# EAGLE design powerlinecontroller (EAGLE 5.08)
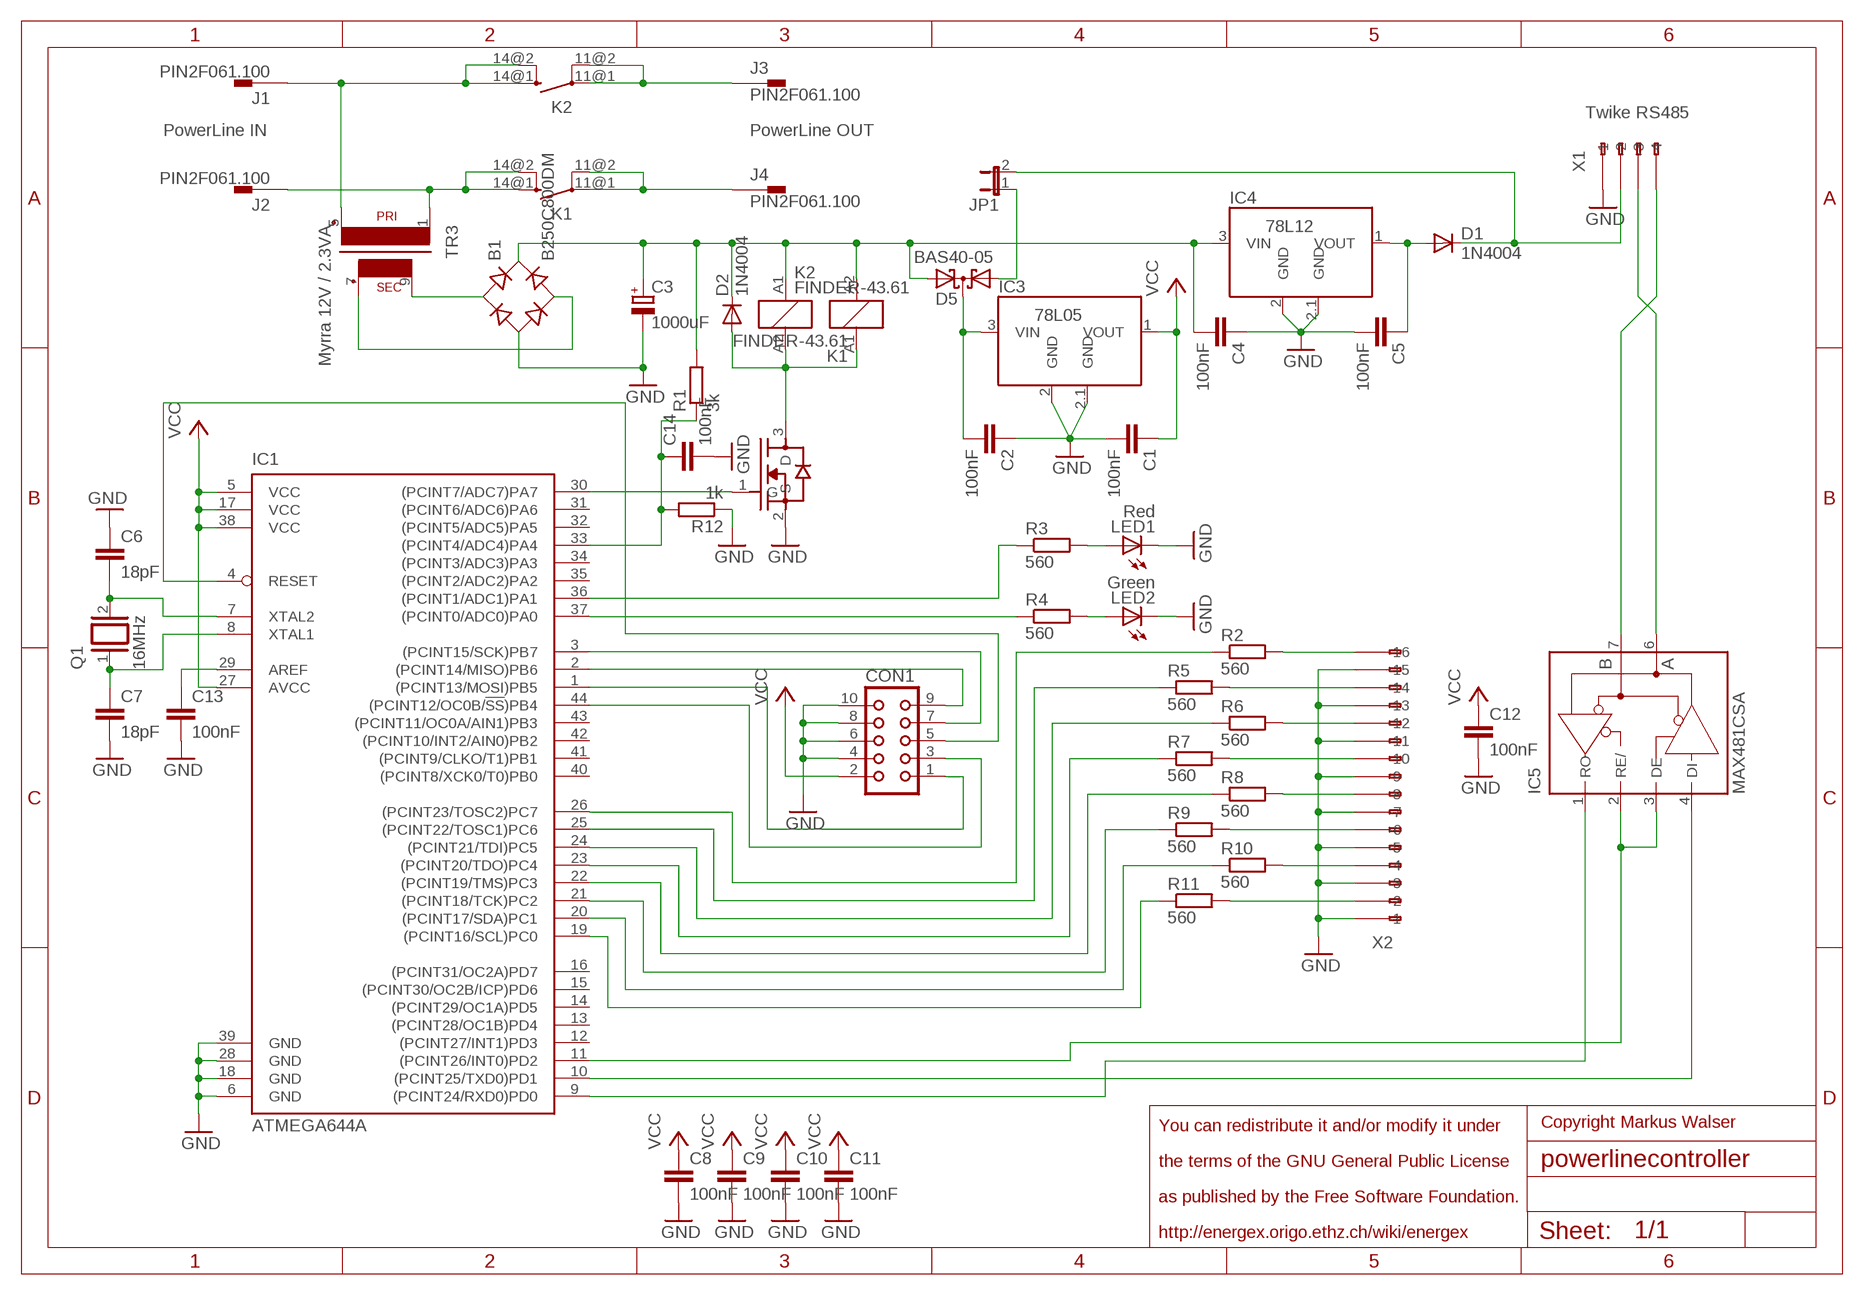
[diagram p0: schematic, sheet 1]

## Parts
B1  B250C800DM  B-DIL  [B-DIL]
C1  100nF  C-EUC0603  [C0603]
C2  100nF  C-EUC0603  [C0603]
C3  1000uF  CPOL-EUE3.5-10  [E3,5-10]
C4  100nF  C-EUC0603  [C0603]
C5  100nF  C-EUC0603  [C0603]
C6  18pF  C-EUC0603K  [C0603K]
C7  18pF  C-EUC0603K  [C0603K]
C8  100nF  C-EUC0603  [C0603]
C9  100nF  C-EUC0603  [C0603]
C10  100nF  C-EUC0603  [C0603]
C11  100nF  C-EUC0603  [C0603]
C12  100nF  C-EUC0603  [C0603]
C13  100nF  C-EUC0603  [C0603]
C14  100nF  C-EUC0603  [C0603]
CON1  CON10  [CON10]
D1  1N4004  [DO41-10]
D2  1N4004  [DO41-10]
D5  BAS40-05  [SOT23]
IC1  ATMEGA644A  [TQFP44]
IC3  78L05  [SOT89]
IC4  78L12  78L05  [SOT89]
IC5  MAX481CSA  [SO08]
J1  PIN2F061.100  [F061.100]
J2  PIN2F061.100  [F061.100]
J3  PIN2F061.100  [F061.100]
J4  PIN2F061.100  [F061.100]
JP1  JP1E  [JP1]
K1  FINDER-43.61  [FINDER-43.61]
K2  FINDER-43.61  [FINDER-43.61]
LED1  Red  LEDCHIPLED_0805  [CHIPLED_0805]
LED2  Green  LEDCHIPLED_0805  [CHIPLED_0805]
Q1  16MHz  XTAL/S  [QS]
R1  3k  R-EU_R0603  [R0603]
R2  560  R-EU_R0603  [R0603]
R3  560  R-EU_R0603  [R0603]
R4  560  R-EU_R0603  [R0603]
R5  560  R-EU_R0603  [R0603]
R6  560  R-EU_R0603  [R0603]
R7  560  R-EU_R0603  [R0603]
R8  560  R-EU_R0603  [R0603]
R9  560  R-EU_R0603  [R0603]
R10  560  R-EU_R0603  [R0603]
R11  560  R-EU_R0603  [R0603]
R12  1k  R-EU_R0603  [R0603]
T1  FDN337  FDN337N  [SOT23]
TR3  Myrra 12V / 2.3VA  VV11  [VV11]
X1  233-104  [233-104]
X2  233-116  [233-116]

## Nets
GND: B1.- C1.2 C2.1 C3.- C4.1 C5.2 C6.1 C7.2 C8.2 C9.2 C10.2 C11.2 C12.2 C13.2 C14.2 CON1.4 CON1.6 CON1.8 CON1.10 IC1.6(GND) IC1.18(GND) IC1.28(GND) IC1.39(GND) IC3.2(GND) IC3.2.1(GND) IC4.2(GND) IC4.2.1(GND) LED1.C LED2.C R12.1 T1.2(S) X1.A1(-1) X2.A1(-1) X2.A3(-3) X2.A5(-5) X2.A7(-7) X2.A9(-9) X2.A11(-11) X2.A13(-13) X2.A15(-15)
N$1: IC1.9((PCINT24/RXD0)PD0) IC5.1(RO)
N$2: IC1.10((PCINT25/TXD0)PD1) IC5.4(DI)
N$3: C14.1 IC1.33((PCINT4/ADC4)PA4) R1.1 R12.2
N$4: D1.C JP1.2 X1.A2(-2)
N$5: C13.1 IC1.29(AREF)
N$6: J2.A1 K1.14@1(-1:SA) K1.14@2(-1:SB) TR3.1
N$7: J1.A1 K2.14@1(-1:SA) K2.14@2(-1:SB) TR3.5(P2)
N$8: J3.A1 K2.11@1(-1:PA) K2.11@2(-1:PB)
N$9: B1.AC1 TR3.9(S4)
N$10: B1.AC2 TR3.7(S3)
N$11: IC5.6(A) X1.A3(-3)
N$12: C5.1 D1.A IC4.1(VOUT)
N$13: IC5.7(B) X1.A4(-4)
N$14: C6.2 IC1.7(XTAL2) Q1.2
N$15: C7.1 IC1.8(XTAL1) Q1.1
N$16: B1.+ C3.+ C4.2 D2.C D5.2(A2) IC4.3(VIN) K1.A2 K2.A1 R1.2
N$17: CON1.1 IC1.1((PCINT13/MOSI)PB5)
N$18: CON1.3 IC1.44((PCINT12/OC0B/!SS!)PB4)
N$19: CON1.5 IC1.4(RESET)
N$20: CON1.7 IC1.3((PCINT15/SCK)PB7)
N$21: CON1.9 IC1.2((PCINT14/MISO)PB6)
N$22: D2.A K1.A1 K2.A2 T1.3(D)
N$23: IC1.30((PCINT7/ADC7)PA7) T1.1(G)
N$24: IC1.37((PCINT0/ADC0)PA0) R4.1
N$25: IC1.36((PCINT1/ADC1)PA1) R3.1
N$26: LED1.A R3.2
N$27: LED2.A R4.2
N$28: IC1.19((PCINT16/SCL)PC0) R11.1
N$29: IC1.20((PCINT17/SDA)PC1) R10.1
N$30: IC1.21((PCINT18/TCK)PC2) R9.1
N$31: IC1.22((PCINT19/TMS)PC3) R8.1
N$32: IC1.23((PCINT20/TDO)PC4) R7.1
N$33: IC1.24((PCINT21/TDI)PC5) R6.1
N$34: IC1.11((PCINT26/INT0)PD2) IC5.2(RE/) IC5.3(DE)
N$35: IC1.25((PCINT22/TOSC1)PC6) R5.1
N$36: IC1.26((PCINT23/TOSC2)PC7) R2.1
N$37: J4.A1 K1.11@1(-1:PA) K1.11@2(-1:PB)
N$38: R2.2 X2.A16(-16)
N$39: R5.2 X2.A14(-14)
N$40: R6.2 X2.A12(-12)
N$41: R7.2 X2.A10(-10)
N$42: R8.2 X2.A8(-8)
N$43: R9.2 X2.A6(-6)
N$44: R10.2 X2.A4(-4)
N$45: R11.2 X2.A2(-2)
N$46: C2.2 D5.3(C) IC3.3(VIN)
N$47: D5.1(A1) JP1.1
VCC: C1.1 C8.1 C9.1 C10.1 C11.1 C12.1 CON1.2 IC1.5(VCC) IC1.17(VCC) IC1.27(AVCC) IC1.38(VCC) IC3.1(VOUT)
Unconnected: IC1.12((PCINT27/INT1)PD3) IC1.13((PCINT28/OC1B)PD4) IC1.14((PCINT29/OC1A)PD5) IC1.15((PCINT30/OC2B/ICP)PD6) IC1.16((PCINT31/OC2A)PD7) IC1.31((PCINT6/ADC6)PA6) IC1.32((PCINT5/ADC5)PA5) IC1.34((PCINT3/ADC3)PA3) IC1.35((PCINT2/ADC2)PA2) IC1.40((PCINT8/XCK0/T0)PB0) IC1.41((PCINT9/CLKO/T1)PB1) IC1.42((PCINT10/INT2/AIN0)PB2) IC1.43((PCINT11/OC0A/AIN1)PB3) J1.A2(1.1) J2.A2(1.1) J3.A2(1.1) J4.A2(1.1) X1.B1(B-1) X1.B2(B-2) X1.B3(B-3) X1.B4(B-4) X2.B1(B-1) X2.B2(B-2) X2.B3(B-3) X2.B4(B-4) X2.B5(B-5) X2.B6(B-6) X2.B7(B-7) X2.B8(B-8) X2.B9(B-9) X2.B10(B-10) X2.B11(B-11) X2.B12(B-12) X2.B13(B-13) X2.B14(B-14) X2.B15(B-15) X2.B16(B-16)

## Notes on the sheet
- Twike RS485
- PowerLine IN | PowerLine OUT
- You can redistribute it and/or modify it under | Copyright Markus Walser
- the terms of the GNU General Public License
- as published by the Free Software Foundation.
- http://energex.origo.ethz.ch/wiki/energex

## Power pins joined to a net without a drawn wire
GND: IC5.5(GND)
VCC: IC5.8(VCC)

## Library data of the parts
B1 = rectifier:B-DIL: RECTIFIER
C1 C2 C4-C14 = rcl:C-EU: CAPACITOR, European symbol
C3 = rcl:CPOL-EU: POLARIZED CAPACITOR, European symbol
CON1 = con-harting:CON10: CONNECTOR
D1 D2 = diode:1N4004: DIODE general purpose rectifier, 1 A
D5 = diode:BAS40-05: Silicon Schottky Diodes General-purpose diode for high-speed switching
IC1 = atmel:ATMEGA644: 8-bit Microcontroller with 64K Bytes In-System Programmable Flash Source: http://www.atmel.com/dyn/resources/prod_documents/doc2593.pdf
IC3 IC4 = supervisor:78L05: Negative voltage regulators
IC5 = maxim:MAX481CSA: RS485 TRANSEIVER
J1-J4 = con-faston:PIN2: Flachstecker Typ Tyco/Electronics/AMP TAB, FASTON Printed Circuit Board Tabs Source: http://www.buerklin.com, http://catalog.tycoelectronics.com
JP1 = jumper:JP1E: JUMPER
K1 K2 = relay:FINDER-43.61: Low profile PCB relays 10 - 16 A FINDER 43 Series Kontakt max. AC- 250V, Strom - Kontakt AC- max. 10A 5 mm contact pin pitch, 1 Pole NO, 16 A, PCB mount Distributor: FARNELL Source: http://www.farnell.com/datasheets/87682.pdf
LED1 LED2 = led:LED: LED OSRAM: - CHIPLED LG R971, LG N971, LY N971, LG Q971, LY Q971, LO R971, LY R971 LH N974, LH R974 LS Q976, LO Q976, LY Q976 LO Q996 - Hyper CHIPLED LW Q18S LB Q993, LB Q99A, LB R99A - SideLED LS A670, LO A670, LY A670, LG A670, LP A670 LB A673, LV A673, LT A673, LW A673 LH A674 LY A675 LS A676, LA A676, LO A676, LY A676, LW A676 LS A679, LY A679, LG A679 - Hyper Micro SIDELED® LS Y876, LA Y876, LO Y876, LY Y876 LT Y87S - SmartLED LW L88C, LW L88S LB L89C, LB L89S, LG L890 LS L89K, LO L89K, LY L89K LS L896, LA L896, LO L896, LY L896 - TOPLED LS T670, LO T670, LY T670, LG T670, LP T670 LSG T670, LSP T670, LSY T670, LOP T670, LYG T670 LG T671, LOG T671, LSG T671 LB T673, LV T673, LT T673, LW T673 LH T674 LS T676, LA T676, LO T676, LY T676, LB T676, LH T676, LSB T676, LW T676 LB T67C, LV T67C, LT T67C, LS T67K, LO T67K, LY T67K, LW E67C LS E67B, LA E67B, LO E67B, LY E67B, LB E67C, LV E67C, LT E67C LW T67C LS T679, LY T679, LG T679 LS T770, LO T770, LY T770, LG T770, LP T770 LB T773, LV T773, LT T773, LW T773 LH T774 LS E675, LA E675, LY E675, LS T675 LS T776, LA T776, LO T776, LY T776, LB T776 LHGB T686 LT T68C, LB T68C - Hyper Mini TOPLED® LB M676 - Mini TOPLED Santana® LG M470 LS M47K, LO M47K, LY M47K Source: http://www.osram.convergy.de LUXEON: - LUMILED® LXK2-PW12-R00, LXK2-PW12-S00, LXK2-PW14-U00, LXK2-PW14-V00 LXK2-PM12-R00, LXK2-PM12-S00, LXK2-PM14-U00 LXK2-PE12-Q00, LXK2-PE12-R00, LXK2-PE12-S00, LXK2-PE14-T00, LXK2-PE14-U00 LXK2-PB12-K00, LXK2-PB12-L00, LXK2-PB12-M00, LXK2-PB14-N00, LXK2-PB14-P00, LXK2-PB14-Q00 LXK2-PR12-L00, LXK2-PR12-M00, LXK2-PR14-Q00, LXK2-PR14-R00 LXK2-PD12-Q00, LXK2-PD12-R00, LXK2-PD12-S00 LXK2-PH12-R00, LXK2-PH12-S00 LXK2-PL12-P00, LXK2-PL12-Q00, LXK2-PL12-R00 Source: www.luxeon.com KINGBRIGHT: KA-3528ASYC Source: www.kingbright.com
Q1 = special:XTAL/S: CRYSTAL
R1-R12 = rcl:R-EU_: RESISTOR, European symbol
T1 = supervisor:FDN337N: N-Channel Logic Level Enhancement Mode Field Effect Transistor
TR3 = trafo:VV11: TRANSFORMER 1 primary winding, 1 secondary winding BLOCK
X1 = con-wago:233-104: WAGO Cage Clamp
X2 = con-wago:233-116: WAGO Cage Clamp

## Board
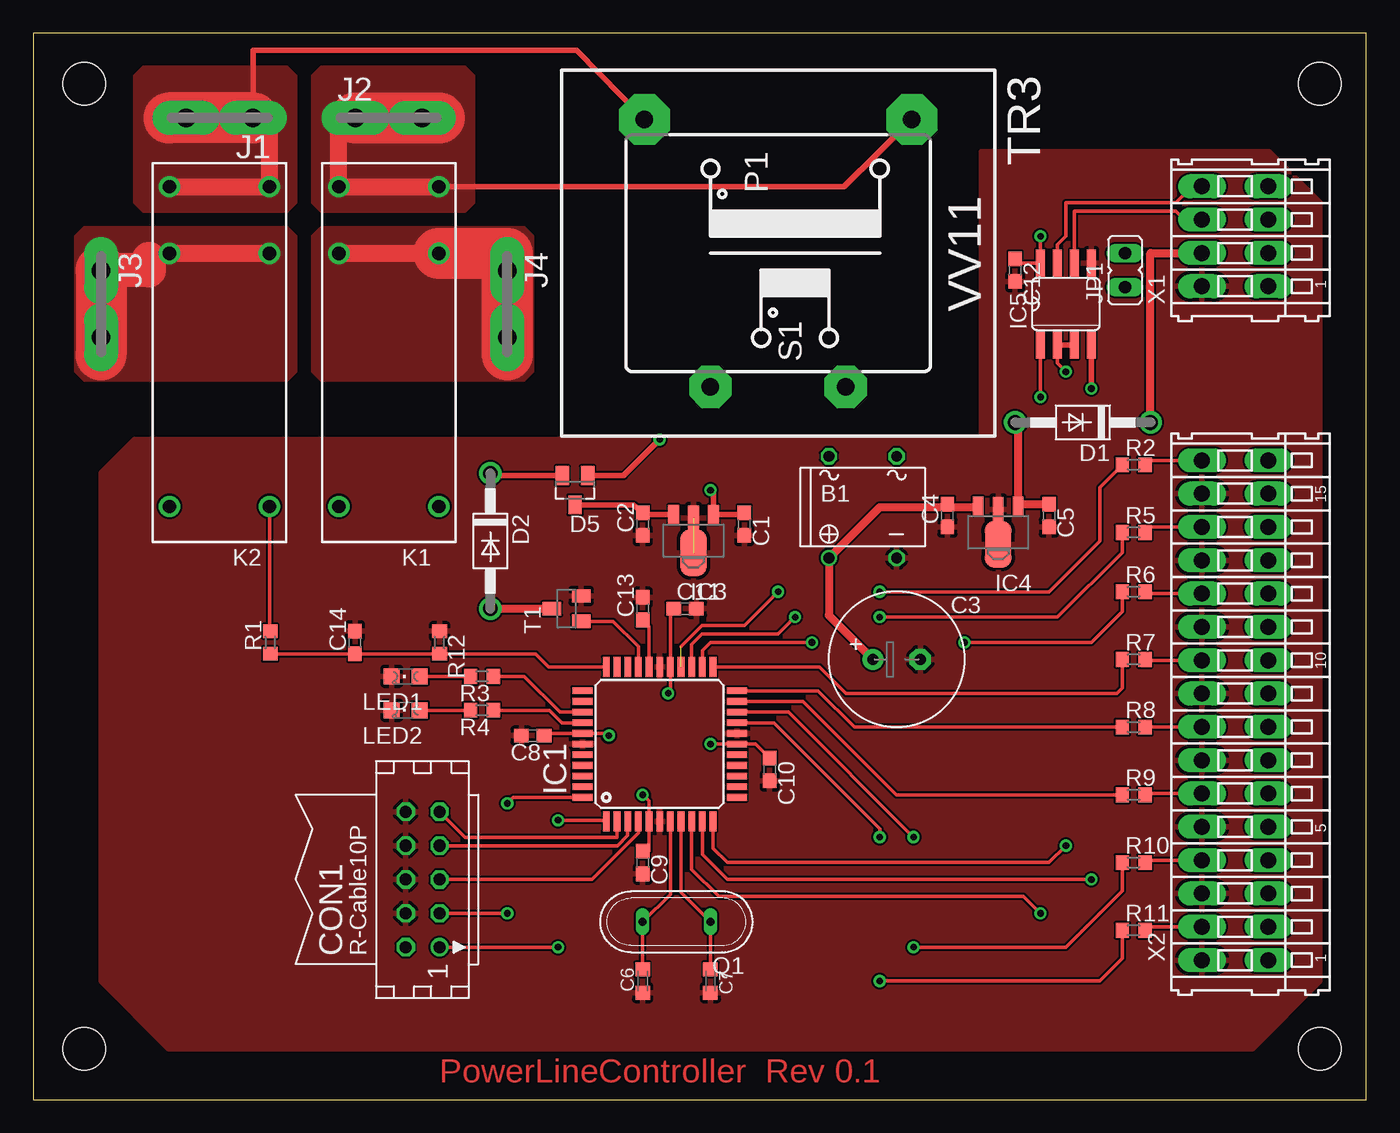
[diagram p1: board, top side]
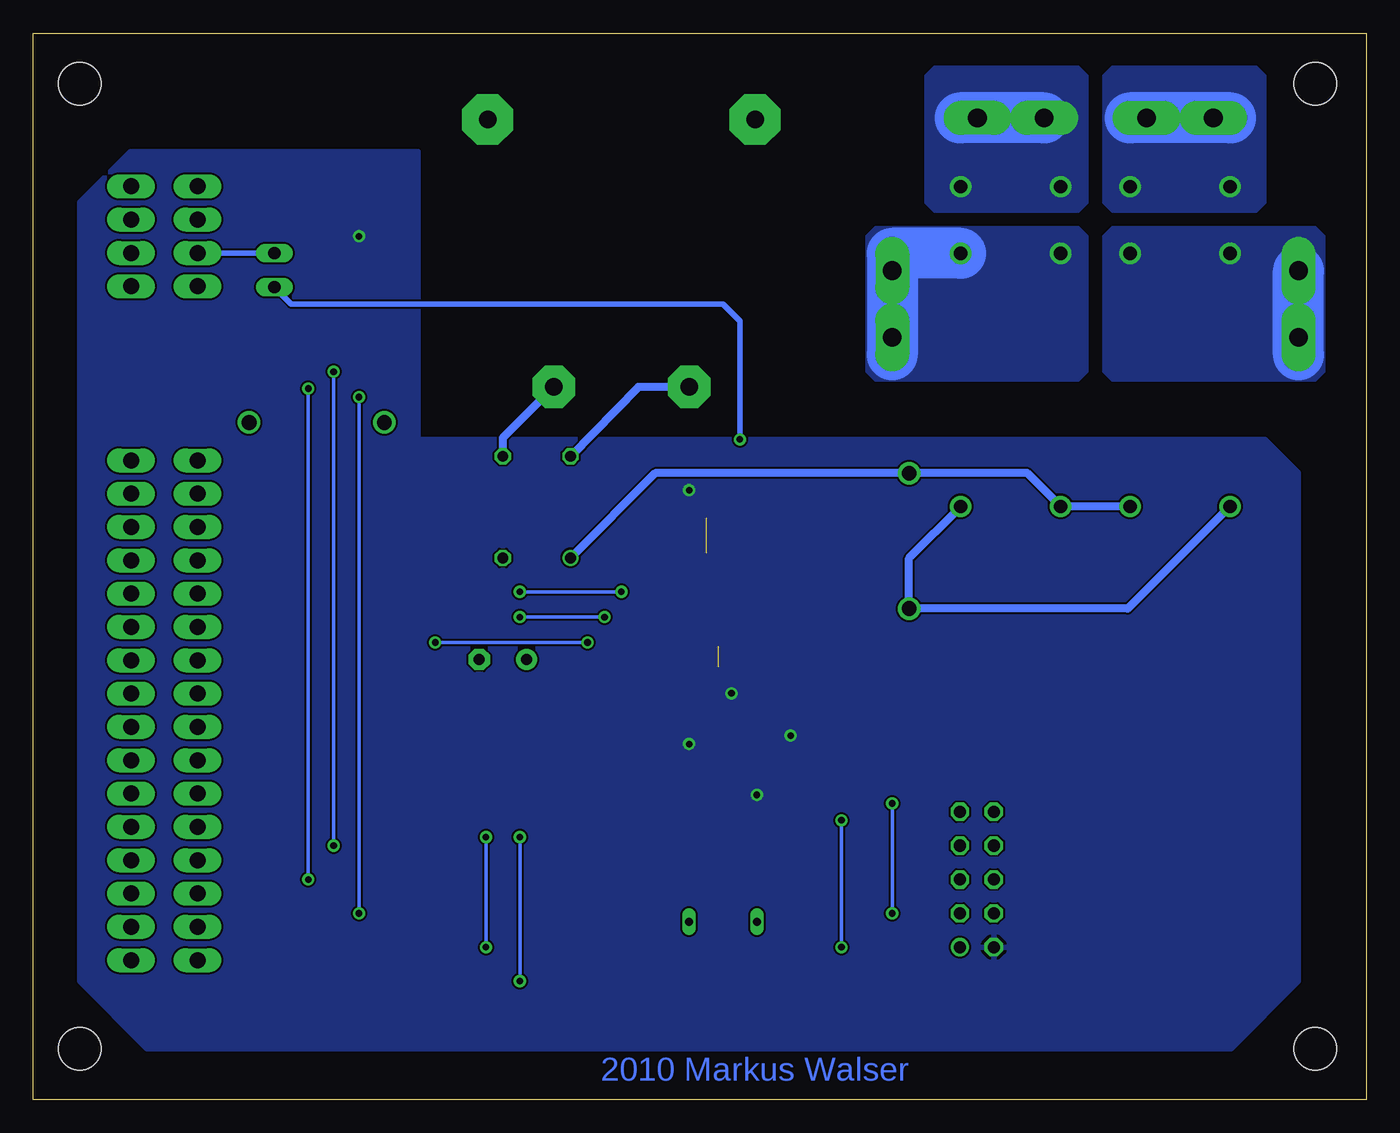
[diagram p2: board, bottom side, seen from below]

Size 100 x 80 mm. Coordinates in mm from the lower left corner, seen from the top.
Outline: 0,0 100,0 100,80 0,80 0,0
Copper layers (1+2*15+16): Top 0.035mm / dielectric 0.36mm / layer 2 0.018mm / dielectric 0.71mm / layer 15 0.018mm / dielectric 0.36mm / Bottom 0.035mm
Design rules "qp_designrules_6mil": minimum track width 6mil, minimum drill 0.3mm, track to track 6mil, track to pad 6mil, pad to pad 6mil, via to via 6mil, smd to smd 6mil, copper to edge 8mil, drill to drill 10mil, minimum pad ring 8mil, minimum via ring 8mil, stop-mask expansion 4mil, vias tented up to drill 16mil, thermal gap 10mil
Holes 3.2 mm at 3.81,76.2 96.52,76.2 96.52,3.81 3.81,3.81

### Footprints (pad centres in the part's own frame; a part is rotated, then mirrored left to right if it is on the bottom)
B-DIL = drill 0.813 round: + -2.54,-3.81 | drill 0.813 octagon: - 2.54,-3.81; AC1 2.54,3.81; AC2 -2.54,3.81
C0603 = smd 1.1 x 1: 1 -0.85,0; 2 0.85,0
E3,5-10 = drill 0.813 pad 1.6 round: + -1.778,0 | drill 0.813 pad 1.6 octagon: - 1.778,0
C0603K = smd 1.05 x 1.08: 1 -0.875,0; 2 0.875,0
CON10 = drill 0.914 round: 1 -5.08,-1.27 | drill 0.914 octagon: 2 -5.08,1.27; 3 -2.54,-1.27; 4 -2.54,1.27; 5 0,-1.27; 6 0,1.27; 7 2.54,-1.27; 8 2.54,1.27; 9 5.08,-1.27; 10 5.08,1.27
DO41-10 = drill 1.118 round: A 5.08,0; C -5.08,0
SOT23 = smd 1 x 1.4: 1 -0.95,-1.1; 2 0.95,-1.1; 3 0,1.1
TQFP44 = smd 1.5 x 0.5: 1 -5.8,4; 2 -5.8,3.2; 3 -5.8,2.4; 4 -5.8,1.6; 5 -5.8,0.8; 6 -5.8,0; 7 -5.8,-0.8; 8 -5.8,-1.6; 9 -5.8,-2.4; 10 -5.8,-3.2; 11 -5.8,-4; 23 5.8,-4; 24 5.8,-3.2; 25 5.8,-2.4; 26 5.8,-1.6; 27 5.8,-0.8; 28 5.8,0; 29 5.8,0.8; 30 5.8,1.6; 31 5.8,2.4; 32 5.8,3.2; 33 5.8,4 | smd 0.5 x 1.5: 12 -4,-5.8; 13 -3.2,-5.8; 14 -2.4,-5.8; 15 -1.6,-5.8; 16 -0.8,-5.8; 17 0,-5.8; 18 0.8,-5.8; 19 1.6,-5.8; 20 2.4,-5.8; 21 3.2,-5.8; 22 4,-5.8; 34 4,5.8; 35 3.2,5.8; 36 2.4,5.8; 37 1.6,5.8; 38 0.8,5.8; 39 0,5.8; 40 -0.8,5.8; 41 -1.6,5.8; 42 -2.4,5.8; 43 -3.2,5.8; 44 -4,5.8
SOT89 = smd 0.8 x 1.4: 1 -1.499,-1.981; 3 1.499,-1.981 | smd 0.8 x 1.9: 2 0,-1.727 | smd 2 x 3.5: 2.1 0,0.889
SO08 = smd 0.66 x 2.032: 1 -1.905,-3.073; 2 -0.635,-3.073; 3 0.635,-3.073; 4 1.905,-3.073; 5 1.905,3.073; 6 0.635,3.073; 7 -0.635,3.073; 8 -1.905,3.073
F061.100 = drill 1.4 pad 2.54 long: A1 -2.5,0; A2 2.5,0
JP1 = drill 0.914 long: 1 0,-1.27; 2 0,1.27
FINDER-43.61 = drill 1 pad 1.6 round: 11@1 0,3.75; 11@2 0,-3.75; 14@1 5,3.75; 14@2 5,-3.75; A1 -19,-3.75; A2 -19,3.75
CHIPLED_0805 = smd 1.2 x 1.2: A 0,-1.05; C 0,1.05
QS = drill 0.61 long: 1 -2.54,0; 2 2.54,0
R0603 = smd 1 x 1.1: 1 -0.85,0; 2 0.85,0
VV11 = drill 1.321 pad 3.81 octagon: 1 -10.033,10.033; 5 -10.033,-10.033 | drill 1.321 pad 3.175 octagon: 7 10.033,-5.08; 9 10.033,5.08
233-104 = drill 1.2 long: A1 -3.75,2.5; A2 -1.25,2.5; A3 1.25,2.5; A4 3.75,2.5; B1 -3.75,-2.5; B2 -1.25,-2.5; B3 1.25,-2.5; B4 3.75,-2.5
233-116 = drill 1.2 long: A1 -18.75,2.5; A2 -16.25,2.5; A3 -13.75,2.5; A4 -11.25,2.5; A5 -8.75,2.5; A6 -6.25,2.5; A7 -3.75,2.5; A8 -1.25,2.5; A9 1.25,2.5; A10 3.75,2.5; A11 6.25,2.5; A12 8.75,2.5; A13 11.25,2.5; A14 13.75,2.5; A15 16.25,2.5; A16 18.75,2.5; B1 -18.75,-2.5; B2 -16.25,-2.5; B3 -13.75,-2.5; B4 -11.25,-2.5; B5 -8.75,-2.5; B6 -6.25,-2.5; B7 -3.75,-2.5; B8 -1.25,-2.5; B9 1.25,-2.5; B10 3.75,-2.5; B11 6.25,-2.5; B12 8.75,-2.5; B13 11.25,-2.5; B14 13.75,-2.5; B15 16.25,-2.5; B16 18.75,-2.5

### Placement (x,y rotation side)
B1  62.23,44.45 0 top
C1  53.34,43.18 270 top
C2  45.72,43.18 90 top
C3  64.77,33.02 0 top
C4  68.58,43.81 90 top
C5  76.2,43.81 270 top
C6  45.72,8.89 90 top
C7  50.8,8.89 270 top
C8  37.47,27.3 180 top
C9  45.72,17.78 270 top
C10  55.24,24.77 270 top
C11  48.9,36.83 0 top
C12  73.66,62.23 270 top
C13  45.72,36.83 90 top
C14  24.13,34.29 90 top
CON1  29.21,16.51 90 top
D1  78.74,50.8 180 top
D2  34.29,41.91 270 top
D5  40.64,45.72 180 top
IC1  46.99,26.67 90 top
IC3  49.53,41.91 180 top
IC4  72.39,42.55 180 top
IC5  77.47,59.69 0 top
J1  13.97,73.66 180 top
J2  26.67,73.66 0 top
J3  5.08,59.69 270 top
J4  35.56,59.69 270 top
JP1  81.92,62.23 0 top
K1  26.67,63.5 90 top
K2  13.97,63.5 90 top
LED1  27.94,31.75 90 top
LED2  27.94,29.21 90 top
Q1  48.26,13.34 180 top
R1  17.78,34.29 90 top
R2  82.55,47.62 0 top
R3  33.66,31.75 180 top
R4  33.66,29.21 180 top
R5  82.55,42.55 0 top
R6  82.55,38.1 0 top
R7  82.55,33.02 0 top
R8  82.55,27.94 0 top
R9  82.55,22.86 0 top
R10  82.55,17.78 0 top
R11  82.55,12.7 0 top
R12  30.48,34.29 270 top
T1  40.01,36.83 90 top
TR3  55.88,63.5 270 top
X1  90.17,64.77 90 top
X2  90.17,29.21 90 top

### Tracks (layer width: path | path; a pad name or v marks a point on that pad's centre or on a via)
GND  (1 unrouted)
  Top 0.406: IC4.2.1 IC4.2
  pour Top: 5.08,8.89 5.08,46.99 7.62,49.53 71.12,49.53 71.12,71.12 92.71,71.12 96.52,67.31 96.52,8.89 91.44,3.81 10.16,3.81
N$1  (via drill 0.5)
  Top 0.254: v75.56,52.7 IC5.1 | v75.56,13.97 74.3,15.24 51.44,15.24 49.39,17.29 IC1.9
  Bottom 0.254: v75.56,13.97 v75.56,52.7
N$2  (via drill 0.5)
  Top 0.254: v79.38,16.51 52.07,16.51 50.19,18.39 IC1.10
  Top 0.406: v79.38,53.34 IC5.4
  Bottom 0.254: v79.38,16.51 v79.38,53.34
N$3
  Top 0.254: IC1.33 38.65,32.47 37.68,33.44 R12.2 C14.1 R1.1
N$4
  Top 0.61: D1.C 83.82,63.52 X1.A2
  Bottom 0.406: X1.A2 81.94,63.52
  Bottom 0.61: 81.94,63.52 JP1.2
N$5
  Top 0.254: IC1.29 46.19,35.51 C13.1
N$6
  Top 0.406: TR3.1 60.83,68.5 K1.14@2
  Top 1.27: K1.14@2 K1.14@1 22.92,73.66 J2.A1
  Top 3.81: J2.A1 30.48,73.66
  Bottom 3.81: J2.A1 30.48,73.66
  pour Top (no thermals): 21.59,77.47 32.38,77.47 33.02,76.83 33.02,67.31 32.38,66.67 21.59,66.67 20.95,67.31 20.95,76.83
  pour Bottom (no thermals): 20.95,76.83 21.59,77.47 32.38,77.47 33.02,76.83 33.02,67.31 32.38,66.67 21.59,66.67 20.95,67.31
N$7
  Top 0.406: TR3.5 40.77,78.74 16.51,78.74 16.51,73.66
  Top 1.27: K2.14@1 K2.14@2 17.72,73.66 16.51,73.66 J1.A1
  Top 3.81: 16.51,73.66 10.16,73.66
  Bottom 3.81: 10.16,73.66 17.72,73.66
  pour Top (no thermals): 8.26,77.47 19.05,77.47 19.68,76.83 19.68,67.31 19.05,66.67 8.26,66.67 7.62,67.31 7.62,76.83
  pour Bottom (no thermals): 8.26,77.47 7.62,76.83 7.62,67.31 8.26,66.67 19.05,66.67 19.68,67.31 19.68,76.83 19.05,77.47
N$8
  Top 1.27: K2.11@2 K2.11@1 10.22,63.46 8.67,63.08 J3.A1
  Top 2.54: 8.67,63.08 8.67,62.23 5.08,62.23
  Top 3.81: 5.08,62.23 5.08,55.88
  Bottom 3.81: 5.08,55.88 J3.A1
  pour Top (no thermals): 3.81,65.41 19.05,65.41 19.68,64.77 19.68,54.61 19.05,53.98 3.81,53.98 3.17,54.61 3.17,64.77
  pour Bottom (no thermals): 19.05,65.41 19.68,64.77 19.68,54.61 19.05,53.98 3.81,53.98 3.17,54.61 3.17,64.77 3.81,65.41
N$9
  Bottom 0.61: TR3.9 64.77,49.66 B1.AC1
N$10
  Bottom 0.61: TR3.7 54.61,53.47 B1.AC2
N$11
  Top 0.254: IC5.6 78.11,66.67 85.72,66.67 86.38,66.02 X1.A3
N$12
  Top 0.61: D1.A 73.89,50.57 IC4.1 74.03,44.66 C5.1
N$13
  Top 0.254: IC5.7 76.83,64.14 77.47,64.77 77.47,67.31 85.72,67.31 87,68.58 87.61,68.58 X1.A4
N$14
  Top 0.254: IC1.7 47.79,15.4 Q1.2 C6.2
N$15
  Top 0.254: IC1.8 48.59,15.54 Q1.1 C7.1
N$16
  Top 0.254: K2.A1 17.72,35.2 R1.2
  Top 0.406: D5.2 34.46,46.82 D2.C
  Top 0.61: C3.+ 59.69,36.32 B1.+ 63.5,44.45 68.36,44.45 C4.2 68.58,44.45 70.81,44.45 IC4.3 | K1.A2
  Bottom 0.61: K2.A1 K1.A2 25.4,46.98 25.4,46.99 D2.C 53.34,46.99 B1.+
N$17  (via drill 0.5)
  Top 0.254: CON1.1 v39.37,11.43 | v39.37,20.95 42.99,20.95 IC1.1
  Bottom 0.254: v39.37,11.43 v39.37,20.95
N$18  (via drill 0.5)
  Top 0.254: CON1.3 v35.56,13.97 | IC1.44 36.01,22.67 v35.56,22.23
  Bottom 0.254: v35.56,13.97 v35.56,22.23
N$19
  Top 0.254: IC1.4 45.39,19.99 41.91,16.51 CON1.5
N$20
  Top 0.254: IC1.3 44.59,19.82 43.81,19.05 CON1.7
N$21
  Top 0.254: CON1.9 32.38,19.68 43.79,19.68 IC1.2
N$22
  Top 0.61: D2.A T1.3
  Bottom 0.61: K2.A2 17.89,36.83 D2.A 34.29,40.63 K1.A1
N$23
  Top 0.254: IC1.30 45.39,33.98 43.49,35.88 T1.1
N$24
  Top 0.254: IC1.37 39.67,28.27 38.73,29.21 R4.1
N$25
  Top 0.254: IC1.36 39.51,29.07 36.83,31.75 R3.1
N$26
  Top 0.254: LED1.A R3.2
N$27
  Top 0.254: LED2.A R4.2
N$28  (via drill 0.5)
  Top 0.254: v63.5,8.89 80.01,8.89 81.7,10.58 R11.1 | IC1.19 55.55,28.27 63.5,20.32 v63.5,19.68
  Bottom 0.254: v63.5,8.89 v63.5,19.68
N$29  (via drill 0.5)
  Top 0.254: IC1.20 56.66,29.07 v66.04,19.68 | v66.04,11.43 77.47,11.43 81.7,15.66 R10.1
  Bottom 0.254: v66.04,11.43 v66.04,19.68
N$30
  Top 0.254: IC1.21 57.76,29.87 64.77,22.86 R9.1
N$31
  Top 0.254: IC1.22 58.87,30.67 61.59,27.94 R8.1
N$32
  Top 0.254: IC1.23 58.97,32.47 60.96,30.48 81.28,30.48 81.7,30.9 R7.1
N$33  (via drill 0.5)
  Top 0.254: v69.85,34.29 79.38,34.29 81.7,36.62 R6.1 | v58.42,34.29 50.8,34.29 50.19,33.68 IC1.24
  Bottom 0.254: v58.42,34.29 v69.85,34.29
N$34  (via drill 0.5)
  Top 0.254: IC5.2 76.83,55.24 v77.47,54.61 | v77.47,19.05 76.2,17.78 52.07,17.78 50.99,18.86 IC1.11
  Top 0.406: IC5.2 IC5.3
  Bottom 0.254: v77.47,19.05 v77.47,54.61
N$35  (via drill 0.5)
  Top 0.254: IC1.25 49.39,34.15 50.16,34.92 55.88,34.92 v57.15,36.2 | R5.1 81.7,41.06 76.83,36.2 v63.5,36.2
  Bottom 0.254: v57.15,36.2 v63.5,36.2
N$36  (via drill 0.5)  (1 unrouted)
  Top 0.254: v55.88,38.1 53.34,35.56 50.16,35.56 48.59,33.98 | v63.5,38.1 76.2,38.1 80.01,41.91 80.01,45.94 R2.1
  Bottom 0.254: v55.88,38.1 v63.5,38.1
N$37
  Top 1.27: K1.11@1 K1.11@2 30.42,63.46
  Top 3.81: K1.11@2 35.56,63.5 35.56,55.88
  Bottom 3.81: K1.11@2 35.56,63.5 35.56,55.88
  pour Top (no thermals): 21.59,65.41 36.83,65.41 37.47,64.77 37.47,54.61 36.83,53.98 21.59,53.98 20.95,54.61 20.95,64.77
  pour Bottom (no thermals): 21.59,65.41 36.83,65.41 37.47,64.77 37.47,54.61 36.83,53.98 21.59,53.98 20.95,54.61 20.95,64.77
N$38
  Top 0.254: X2.A16 83.73,47.96 R2.2
N$39
  Top 0.254: X2.A14 83.81,42.96 R5.2
N$40
  Top 0.254: X2.A12 83.54,37.96 R6.2
N$41
  Top 0.254: X2.A10 83.46,32.96 R7.2
N$42
  Top 0.254: X2.A8 83.42,27.96 R8.2
N$43
  Top 0.254: X2.A6 83.5,22.96 R9.2
N$44
  Top 0.254: X2.A4 83.58,17.96 R10.2
N$45
  Top 0.254: X2.A2 83.66,12.96 R11.2
N$46
  Top 0.406: IC3.3 45.86,43.89 C2.2 45.04,44.62 D5.3
N$47  (via drill 0.5)
  Top 0.406: v46.99,49.53 44.28,46.82 D5.1
  Bottom 0.406: JP1.1 80.64,59.69 48.26,59.69 46.99,58.42 v46.99,49.53
VCC  (via drill 0.5)
  Top 0.254: v75.56,64.77 IC5.8 73.98,62.76 arc-90 C12.1 | C8.1 38.48,27.47 IC1.38 43.02,27.47 v43.18,27.3 | v50.8,26.67 IC1.17 54.19,26.67 C10.1 | C9.1 46.19,18.67 IC1.5 46.19,22.39 v45.72,22.86 | v47.62,30.48 47.79,30.64 IC1.27 47.79,36.58 C11.1
  Top 0.406: C1.1 53.2,43.89 IC3.1 51.03,45.49 v50.8,45.72
  pour Bottom: 10.16,3.81 91.44,3.81 96.52,8.89 96.52,67.31 92.71,71.12 71.12,71.12 71.12,49.53 7.62,49.53 5.08,46.99 5.08,8.89

### Text on the board
Top: PowerLineController Rev 0.1
Bottom: 2010 Markus Walser
Document: P-IN | N-IN | ext. | Twike-Com | P_OUT | N-OUT | GPIO | ISP